# EAGLE design 1541-3mf (EAGLE 6.6.0)
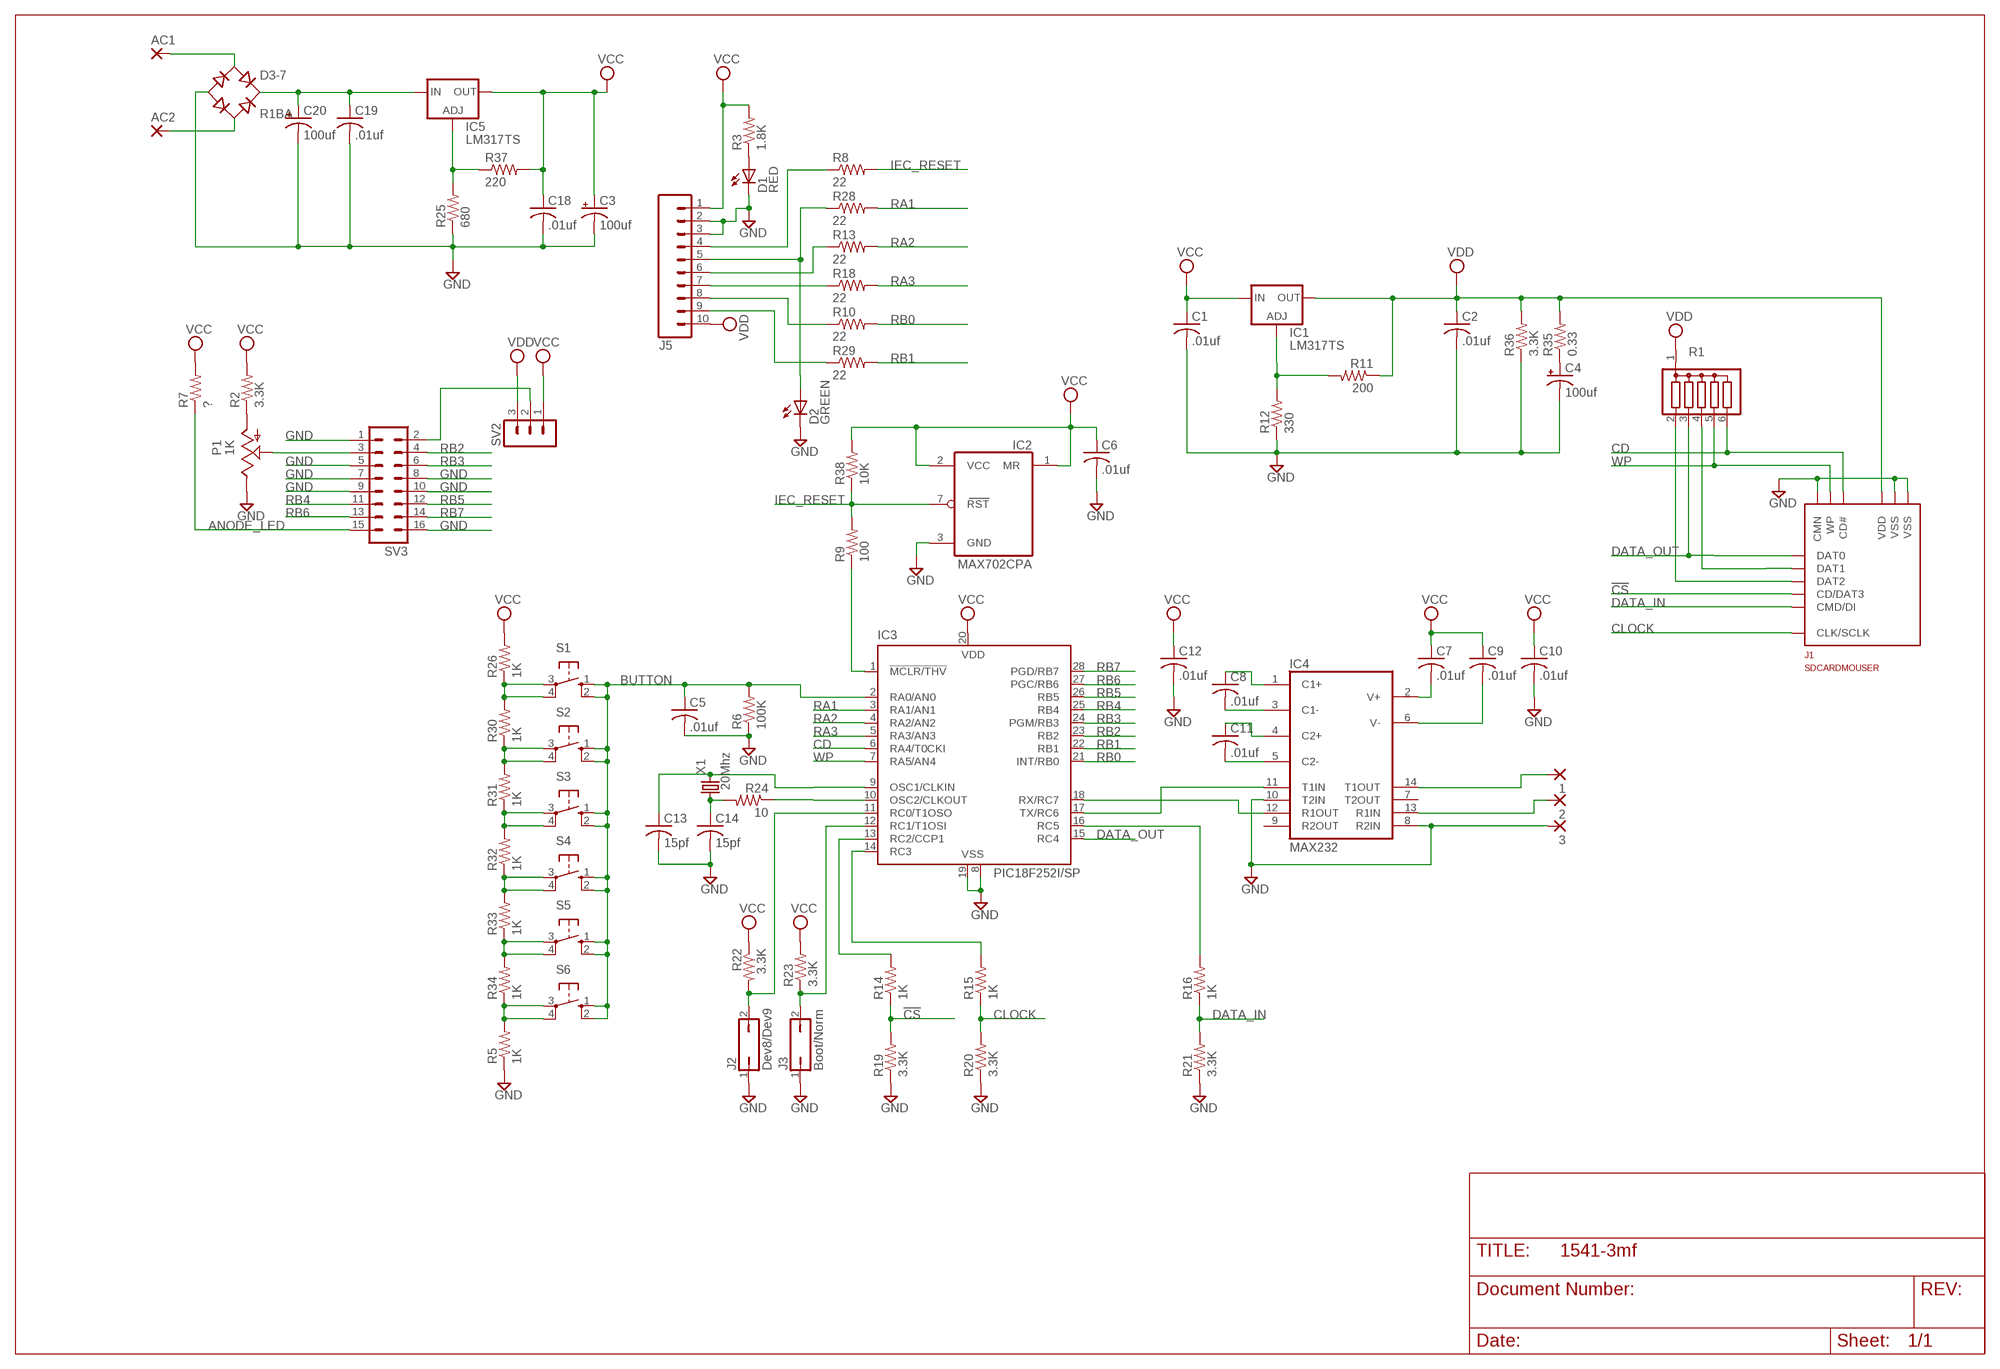
[diagram p0: schematic, sheet 1]

## Parts
1  2,15/1,0  [2,15/1,0]
2  2,15/1,0  [2,15/1,0]
3  2,15/1,0  [2,15/1,0]
AC1  2,15/1,0  [2,15/1,0]
AC2  2,15/1,0  [2,15/1,0]
C1  .01uf  C-US025-024X044  [C025-024X044]
C2  .01uf  C-US025-024X044  [C025-024X044]
C3  100uf  CPOL-USE2-5  [E2-5]
C4  100uf  CPOL-USE2-5  [E2-5]
C5  .01uf  C-US025-024X044  [C025-024X044]
C6  .01uf  C-US025-024X044  [C025-024X044]
C7  .01uf  C-US025-024X044  [C025-024X044]
C8  .01uf  C-US025-024X044  [C025-024X044]
C9  .01uf  C-US025-024X044  [C025-024X044]
C10  .01uf  C-US025-024X044  [C025-024X044]
C11  .01uf  C-US025-024X044  [C025-024X044]
C12  .01uf  C-US025-024X044  [C025-024X044]
C13  15pf  C-US025-024X044  [C025-024X044]
C14  15pf  C-US025-024X044  [C025-024X044]
C18  .01uf  C-US025-024X044  [C025-024X044]
C19  .01uf  C-US025-024X044  [C025-024X044]
C20  100uf  CPOL-USE2-5  [E2-5]
D1  RED  LED3MM  [LED3MM]
D2  GREEN  LED3MM  [LED3MM]
D3-7  R1BA  RB1A  [RB1A]
IC1  LM317TS  [317TS]
IC2  MAX702CPA  [DIL08]
IC3  PIC18F252I/SP  PIC16F870P  [DIL28-3]
IC4  MAX232  [DIL16]
IC5  LM317TS  [317TS]
J1  SDCARDMOUSER  [SCDA1A]
J2  Dev8/Dev9  JP1Q  [JP1]
J3  Boot/Norm  JP1Q  [JP1]
J5  M10  [10P]
P1  1K  TRIM_US-LI10  [LI10]
R1  G05R  [SIL6]
R2  3.3K  R-US_0207/7  [0207/7]
R3  1.8K  R-US_0207/7  [0207/7]
R5  1K  R-US_0207/7  [0207/7]
R6  100K  R-US_0207/7  [0207/7]
R7  ?  R-US_0207/7  [0207/7]
R8  22  R-US_0207/7  [0207/7]
R9  100  R-US_0207/7  [0207/7]
R10  22  R-US_0207/7  [0207/7]
R11  200  R-US_0207/7  [0207/7]
R12  330  R-US_0207/7  [0207/7]
R13  22  R-US_0207/7  [0207/7]
R14  1K  R-US_0207/7  [0207/7]
R15  1K  R-US_0207/7  [0207/7]
R16  1K  R-US_0207/7  [0207/7]
R18  22  R-US_0207/7  [0207/7]
R19  3.3K  R-US_0207/7  [0207/7]
R20  3.3K  R-US_0207/7  [0207/7]
R21  3.3K  R-US_0207/7  [0207/7]
R22  3.3K  R-US_0207/7  [0207/7]
R23  3.3K  R-US_0207/7  [0207/7]
R24  10  R-US_0207/7  [0207/7]
R25  680  R-US_0207/7  [0207/7]
R26  1K  R-US_0207/7  [0207/7]
R28  22  R-US_0207/7  [0207/7]
R29  22  R-US_0207/7  [0207/7]
R30  1K  R-US_0207/7  [0207/7]
R31  1K  R-US_0207/7  [0207/7]
R32  1K  R-US_0207/7  [0207/7]
R33  1K  R-US_0207/7  [0207/7]
R34  1K  R-US_0207/7  [0207/7]
R35  0.33  R-US_0207/7  [0207/7]
R36  3.3K  R-US_0207/7  [0207/7]
R37  220  R-US_0207/7  [0207/7]
R38  10K  R-US_0207/7  [0207/7]
S1  10-XX  [B3F-10XX]
S2  10-XX  [B3F-10XX]
S3  10-XX  [B3F-10XX]
S4  10-XX  [B3F-10XX]
S5  10-XX  [B3F-10XX]
S6  10-XX  [B3F-10XX]
SV2  MA03-1  [MA03-1]
SV3  ML16  [ML16]
X1  20Mhz  CRYSTALHC49U70  [HC49U70]

## Nets
!CS: J1.1(CD/DAT3) R14.1 R19.2
ANODE_LED: R7.1 SV3.15
BUTTON: C5.1 IC3.2(RA0/AN0) R6.2 S1.1(S) S1.2(S1) S2.1(S) S2.2(S1) S3.1(S) S3.2(S1) S4.1(S) S4.2(S1) S5.1(S) S5.2(S1) S6.1(S) S6.2(S1)
CD: IC3.6(RA4/T0CKI) J1.10(CD#) R1.6
CLOCK: J1.5(CLK/SCLK) R15.1 R20.2
DATA_IN: J1.2(CMD/DI) R16.1 R21.2
DATA_OUT: IC3.15(RC4) J1.7(DAT0) R1.3
GND: 3.1(P) C1.2 C2.2 C3.- C4.- C5.2 C6.2 C10.2 C12.2 C13.2 C14.2 C18.2 C19.2 C20.- D1.K(C) D2.K(C) D3-7.- IC2.3(GND) IC3.8(VSS) IC3.19(VSS) IC4.8(R2IN) IC4.10(T2IN) J1.3(VSS) J1.6(VSS) J1.11(CMN) J2.1 J3.1 J5.2 J5.3 P1.E R5.1 R6.1 R12.1 R19.1 R20.1 R21.1 R25.1 R36.1 SV3.1 SV3.5 SV3.7 SV3.8 SV3.9 SV3.10 SV3.16
IEC_RESET: IC2.7(RST) R8.2 R9.2 R38.1
N$1: C4.+ R35.1
N$2: J1.9(DAT2) R1.2
N$3: J1.8(DAT1) R1.4
N$4: J5.9 R29.1
N$5: J5.8 R10.1
N$6: J5.7 R18.1
N$7: J5.4 R8.1
N$8: D2.A J5.5 R28.1
N$9: J5.6 R13.1
N$10: D1.A R3.1
N$11: IC3.18(RX/RC7) IC4.12(R1OUT)
N$12: IC3.14(RC3) R15.2
N$13: C14.1 R24.2 X1.1
N$14: IC3.1(!MCLR/THV) R9.1
N$15: C11.1 IC4.4(C2+)
N$16: C11.2 IC4.5(C2-)
N$17: C8.2 IC4.3(C1-)
N$18: C8.1 IC4.1(C1+)
N$19: C7.2 IC4.2(V+)
N$20: C13.1 IC3.9(OSC1/CLKIN) X1.2
N$21: IC3.10(OSC2/CLKOUT) R24.1
N$22: IC3.12(RC1/T1OSI) J3.2 R23.1
N$23: IC3.11(RC0/T1OSO) J2.2 R22.2
N$24: IC3.13(RC2/CCP1) R14.2
N$25: IC3.16(RC5) R16.2
N$26: IC1.1(ADJ) R11.2 R12.2
N$27: IC3.17(TX/RC6) IC4.11(T1IN)
N$28: R26.1 R30.2 S1.3(P) S1.4(P1)
N$29: R30.1 R31.2 S2.3(P) S2.4(P1)
N$30: R31.1 R32.2 S3.3(P) S3.4(P1)
N$31: R5.2 R34.1 S6.3(P) S6.4(P1)
N$32: R33.1 R34.2 S5.3(P) S5.4(P1)
N$33: R32.1 R33.2 S4.3(P) S4.4(P1)
N$34: P1.A R2.1
N$35: SV2.2 SV3.2
N$36: P1.S SV3.3
N$37: C9.2 IC4.6(V-)
N$38: IC5.1(ADJ) R25.2 R37.1
N$39: AC1.1(P) D3-7.AC1
N$40: C19.1 C20.+ D3-7.+ IC5.3(IN)
N$41: AC2.1(P) D3-7.AC2
N$42: 2.1(P) IC4.13(R1IN)
N$43: 1.1(P) IC4.14(T1OUT)
RA1: IC3.3(RA1/AN1) R28.2
RA2: IC3.4(RA2/AN2) R13.2
RA3: IC3.5(RA3/AN3) R18.2
RB0: IC3.21(INT/RB0) R10.2
RB1: IC3.22(RB1) R29.2
RB2: IC3.23(RB2) SV3.4
RB3: IC3.24(PGM/RB3) SV3.6
RB4: IC3.25(RB4) SV3.11
RB5: IC3.26(RB5) SV3.12
RB6: IC3.27(PGC/RB6) SV3.13
RB7: IC3.28(PGD/RB7) SV3.14
VCC: C1.1 C3.+ C6.1 C7.1 C9.1 C10.1 C12.1 C18.1 IC1.3(IN) IC2.1(MR) IC2.2(VCC) IC3.20(VDD) IC5.2(OUT) J5.1 R2.2 R3.2 R7.2 R22.1 R23.2 R26.2 R37.2 R38.2 SV2.1
VDD: C2.1 IC1.2(OUT) J1.4(VDD) J5.10 R1.1 R11.1 R35.2 R36.2 SV2.3
WP: IC3.7(RA5/AN4) J1.12(WP) R1.5
Unconnected: IC4.7(T2OUT) IC4.9(R2OUT)

## Power pins joined to a net without a drawn wire
GND: IC4.15(GND) J1.13(GND) J1.14(GND)
VCC: IC4.16(VCC)

## Library data of the parts
1-3 AC1 AC2 = wirepad:2,15/1,0: THROUGH-HOLE PAD
C1 C2 C5-C14 C18 C19 = rcl:C-US: CAPACITOR, American symbol
C3 C4 C20 = rcl:CPOL-US: POLARIZED CAPACITOR, American symbol
D1 D2 = led:LED: LED OSRAM: - CHIPLED LG R971, LG N971, LY N971, LG Q971, LY Q971, LO R971, LY R971 LH N974, LH R974 LS Q976, LO Q976, LY Q976 LO Q996 - Hyper CHIPLED LW Q18S LB Q993, LB Q99A, LB R99A - SideLED LS A670, LO A670, LY A670, LG A670, LP A670 LB A673, LV A673, LT A673, LW A673 LH A674 LY A675 LS A676, LA A676, LO A676, LY A676, LW A676 LS A679, LY A679, LG A679 - Hyper Micro SIDELED® LS Y876, LA Y876, LO Y876, LY Y876 LT Y87S - SmartLED LW L88C, LW L88S LB L89C, LB L89S, LG L890 LS L89K, LO L89K, LY L89K LS L896, LA L896, LO L896, LY L896 - TOPLED LS T670, LO T670, LY T670, LG T670, LP T670 LSG T670, LSP T670, LSY T670, LOP T670, LYG T670 LG T671, LOG T671, LSG T671 LB T673, LV T673, LT T673, LW T673 LH T674 LS T676, LA T676, LO T676, LY T676, LB T676, LH T676, LSB T676, LW T676 LB T67C, LV T67C, LT T67C, LS T67K, LO T67K, LY T67K, LW E67C LS E67B, LA E67B, LO E67B, LY E67B, LB E67C, LV E67C, LT E67C LW T67C LS T679, LY T679, LG T679 LS T770, LO T770, LY T770, LG T770, LP T770 LB T773, LV T773, LT T773, LW T773 LH T774 LS E675, LA E675, LY E675, LS T675 LS T776, LA T776, LO T776, LY T776, LB T776 LHGB T686 LT T68C, LB T68C - Hyper Mini TOPLED® LB M676 - Mini TOPLED Santana® LG M470 LS M47K, LO M47K, LY M47K Source: http://www.osram.convergy.de LUXEON: - LUMILED® LXK2-PW12-R00, LXK2-PW12-S00, LXK2-PW14-U00, LXK2-PW14-V00 LXK2-PM12-R00, LXK2-PM12-S00, LXK2-PM14-U00 LXK2-PE12-Q00, LXK2-PE12-R00, LXK2-PE12-S00, LXK2-PE14-T00, LXK2-PE14-U00 LXK2-PB12-K00, LXK2-PB12-L00, LXK2-PB12-M00, LXK2-PB14-N00, LXK2-PB14-P00, LXK2-PB14-Q00 LXK2-PR12-L00, LXK2-PR12-M00, LXK2-PR14-Q00, LXK2-PR14-R00 LXK2-PD12-Q00, LXK2-PD12-R00, LXK2-PD12-S00 LXK2-PH12-R00, LXK2-PH12-S00 LXK2-PL12-P00, LXK2-PL12-Q00, LXK2-PL12-R00 Source: www.luxeon.com KINGBRIGHT: KA-3528ASYC Source: www.kingbright.com
D3-7 = rectifier:RB1A: RECTIFIER 1 A
IC1 IC5 = v-reg:LM317TS: VOLTAGE REGULATOR
IC2 = maxim:MAX702CPA: POWER SUPPLY MONITOR; MF: MAXIM; MPN: MAX702CPA+; OC_FARNELL: 1188018; OC_NEWARK: 69K6744
IC3 = microchip:PIC16*870: MICROCONTROLLER flash type; MF: MICROCHIP; MPN: PIC16F870-I/SP; OC_FARNELL: 9760954; OC_NEWARK: 19C7275
IC4 = maxim:MAX232: RS232 TRANSCEIVER; MF: MAXIM; MPN: MAX232ACPE+; OC_FARNELL: 9723773; OC_NEWARK: 68K4544
J1 = sdcards:SDCARD: SD Card Holder
J2 J3 = jumper:JP1Q: JUMPER
J5 = con-amp-quick:M10: AMP QUICK CONNECTOR; OC_FARNELL: unknown; OC_NEWARK: unknown
P1 = pot:TRIM_US-: POTENTIOMETER
R1 = resistor-sil:G05R: SIL RESISTOR; OC_FARNELL: unknown; OC_NEWARK: unknown
R2 R3 R5-R16 R18-R26 R28-R38 = rcl:R-US_: RESISTOR, American symbol
S1-S6 = switch-omron:10-XX: OMRON SWITCH; MPN: B3F-1000; OC_FARNELL: 176432; OC_NEWARK: 36M3542
SV2 = con-lstb:MA03-1: PIN HEADER; OC_FARNELL: unknown; OC_NEWARK: unknown
SV3 = con-harting-ml:ML16: HARTING; OC_FARNELL: unknown; OC_NEWARK: unknown
X1 = crystal:CRYSTAL: CRYSTAL; OC_FARNELL: unknown; OC_NEWARK: unknown

## Board
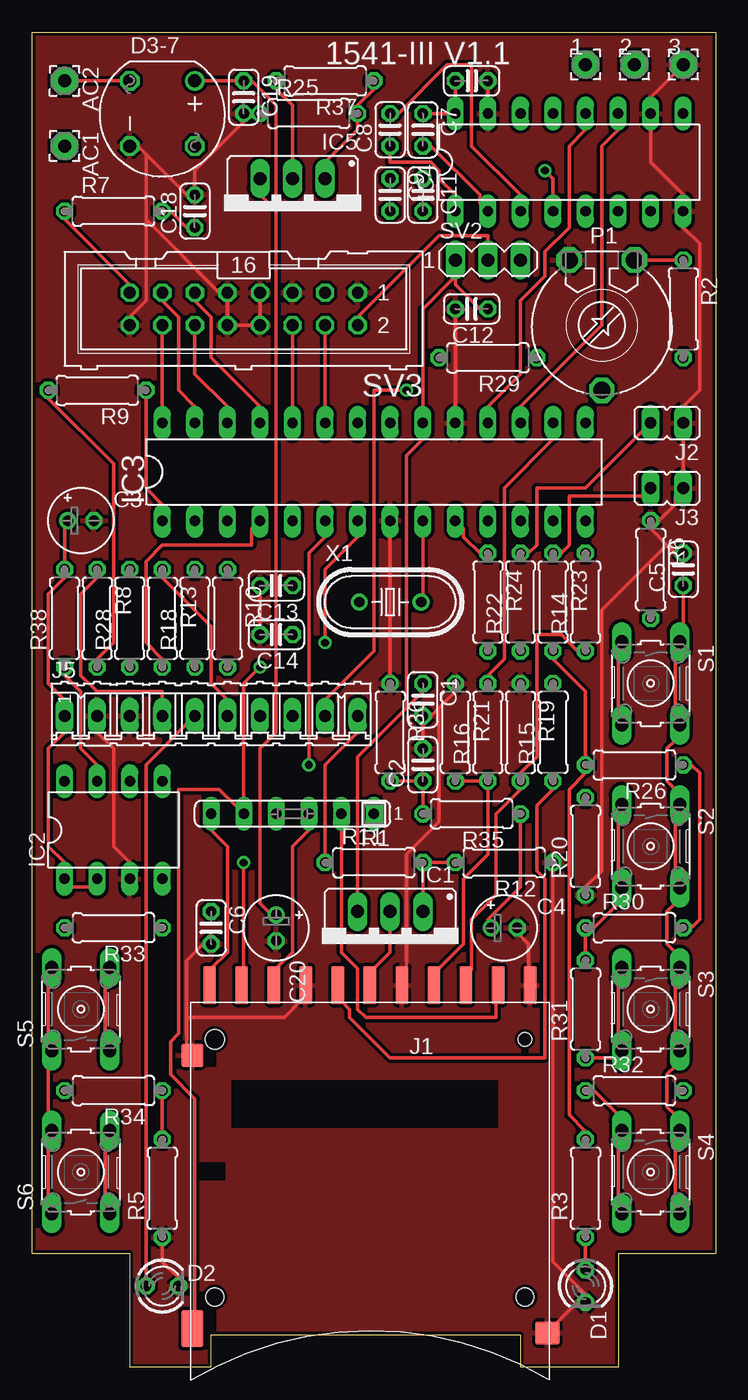
[diagram p1: board, top side]
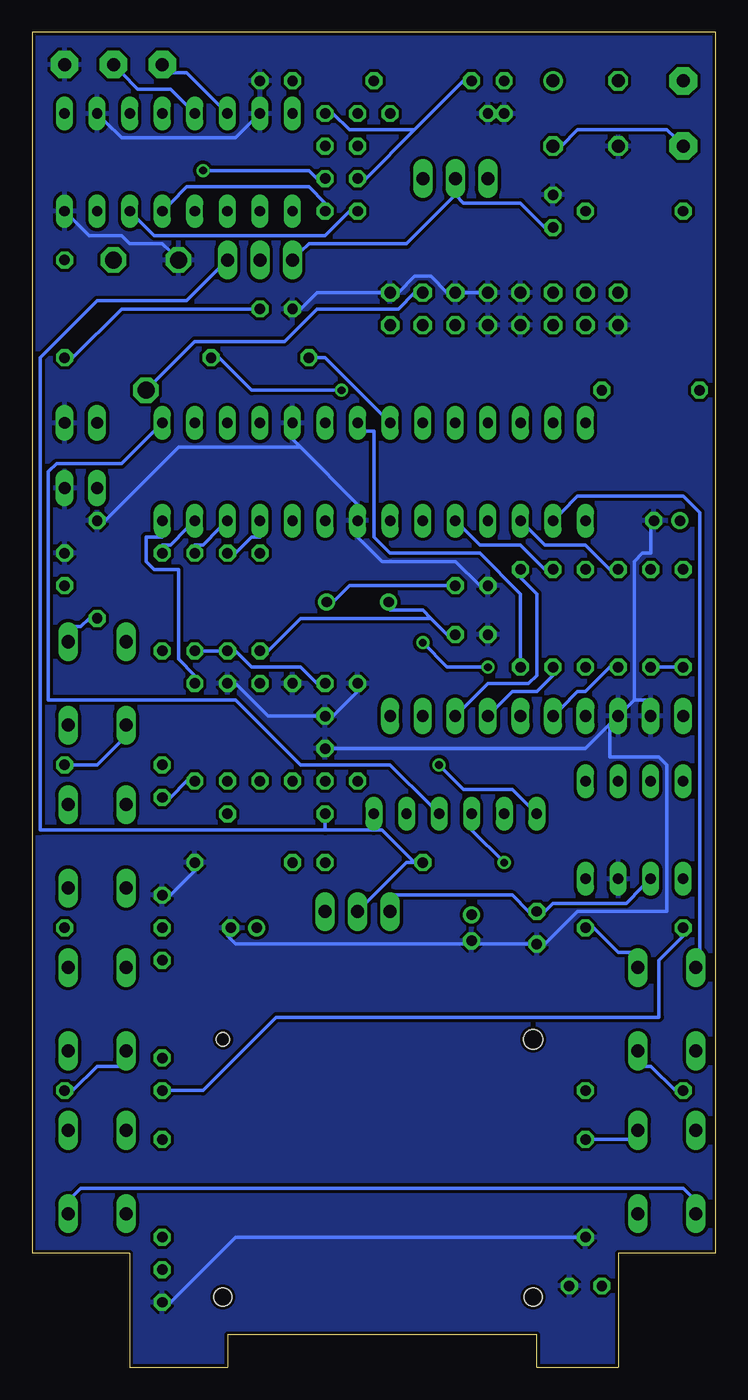
[diagram p2: board, bottom side, seen from below]

Size 53.34 x 104.14 mm. Coordinates in mm from the lower left corner, seen from the top.
Outline: 0,104.14 53.34,104.14 53.34,8.89 45.72,8.89 45.72,0 38.1,0 38.1,2.54 13.97,2.54 13.97,0 7.62,0 7.62,8.89 0,8.89 0,104.14
Copper layers (1*16): Top 0.035mm / dielectric 1.5mm / Bottom 0.035mm
Design rules "olimex10mil": minimum track width 10mil, minimum drill 24mil, track to track 10mil, track to pad 10mil, pad to pad 10mil, via to via 10mil, smd to smd 10mil, copper to edge 10mil, drill to drill 10mil, minimum pad ring 10mil, minimum via ring 8mil, stop-mask expansion 0mil, vias tented up to drill 0mil, thermal gap 10mil

### Footprints (pad centres in the part's own frame; a part is rotated, then mirrored left to right if it is on the bottom)
2,15/1,0 = drill 1.016 pad 2.159 octagon: 1 0,0
C025-024X044 = drill 0.813 octagon: 1 -1.27,0; 2 1.27,0
E2-5 = drill 0.813 pad 1.27: + -1.016,0 | drill 0.813 pad 1.27 octagon: - 1.016,0
LED3MM = drill 0.813 octagon: A -1.27,0; K 1.27,0
RB1A = drill 1.016: + -2.54,2.54 | drill 1.016 octagon: - 2.54,-2.54; AC1 2.54,2.54; AC2 -2.54,-2.54
317TS = drill 1.016 long: 1 -2.54,-2.54; 2 0,-2.54; 3 2.54,-2.54
DIL08 = drill 0.813 long: 1 -3.81,-3.81; 2 -1.27,-3.81; 3 1.27,-3.81; 4 3.81,-3.81; 5 3.81,3.81; 6 1.27,3.81; 7 -1.27,3.81; 8 -3.81,3.81
DIL28-3 = drill 0.813 long: 1 -16.51,-3.81; 2 -13.97,-3.81; 3 -11.43,-3.81; 4 -8.89,-3.81; 5 -6.35,-3.81; 6 -3.81,-3.81; 7 -1.27,-3.81; 8 1.27,-3.81; 9 3.81,-3.81; 10 6.35,-3.81; 11 8.89,-3.81; 12 11.43,-3.81; 13 13.97,-3.81; 14 16.51,-3.81; 15 16.51,3.81; 16 13.97,3.81; 17 11.43,3.81; 18 8.89,3.81; 19 6.35,3.81; 20 3.81,3.81; 21 1.27,3.81; 22 -1.27,3.81; 23 -3.81,3.81; 24 -6.35,3.81; 25 -8.89,3.81; 26 -11.43,3.81; 27 -13.97,3.81; 28 -16.51,3.81
DIL16 = drill 0.813 long: 1 -8.89,-3.81; 2 -6.35,-3.81; 3 -3.81,-3.81; 4 -1.27,-3.81; 5 1.27,-3.81; 6 3.81,-3.81; 7 6.35,-3.81; 8 8.89,-3.81; 9 8.89,3.81; 10 6.35,3.81; 11 3.81,3.81; 12 1.27,3.81; 13 -1.27,3.81; 14 -3.81,3.81; 15 -6.35,3.81; 16 -8.89,3.81
SCDA1A = smd 1 x 2.95: 1 -7.5,-10.125; 2 -5,-10.125; 3 -2.5,-10.125; 4 0,-10.125; 5 2.5,-10.125; 6 5,-10.125; 7 7.5,-10.125; 8 10,-10.125; 9 -10,-10.125; 10 12.5,-10.125; 13 -12.5,-10.125 | smd 1.7 x 1.8: 11 13.85,-4.65 | smd 1.7 x 2.9: 12 13.85,16.65 | smd 1.9 x 1.8: 14 -13.85,17 | hole 1.05: -12.1,-5.9 | hole 1.5: 12.1,-5.9 | hole 1.4: 12.1,14.2; -12.1,14.2
JP1 = drill 0.914 long: 1 0,-1.27; 2 0,1.27
10P = drill 0.914 long: 1 -11.43,0; 2 -8.89,0; 3 -6.35,0; 4 -3.81,0; 5 -1.27,0; 6 1.27,0; 7 3.81,0; 8 6.35,0; 9 8.89,0; 10 11.43,0
LI10 = drill 1.321 octagon: A -2.54,-5.08; E 2.54,-5.08; S 0,5.08
SIL6 = drill 0.813 long: 1 -6.35,0; 2 -3.81,0; 3 -1.27,0; 4 1.27,0; 5 3.81,0; 6 6.35,0
0207/7 = drill 0.813 octagon: 1 -3.81,0; 2 3.81,0
B3F-10XX = drill 1.016 long: 1 -3.251,2.261; 2 3.251,2.261; 3 -3.251,-2.261; 4 3.251,-2.261
MA03-1 = drill 1.016 long: 1 -2.54,0; 2 0,0; 3 2.54,0
ML16 = drill 0.914 octagon: 1 -8.89,-1.27; 2 -8.89,1.27; 3 -6.35,-1.27; 4 -6.35,1.27; 5 -3.81,-1.27; 6 -3.81,1.27; 7 -1.27,-1.27; 8 -1.27,1.27; 9 1.27,-1.27; 10 1.27,1.27; 11 3.81,-1.27; 12 3.81,1.27; 13 6.35,-1.27; 14 6.35,1.27; 15 8.89,-1.27; 16 8.89,1.27
HC49U70 = drill 0.813: 1 -2.413,0; 2 2.413,0

### Placement (x,y rotation side)
1  43.18,101.6 0 top
2  46.99,101.6 0 top
3  50.8,101.6 0 top
AC1  2.54,95.25 270 top
AC2  2.54,100.33 270 top
C1  30.48,52.07 270 top
C2  30.48,46.99 90 top
C3  3.81,66.04 0 top
C4  36.83,34.29 0 top
C5  50.8,62.23 90 top
C6  13.97,34.29 270 top
C7  30.48,96.52 270 top
C8  27.94,96.52 90 top
C9  27.94,91.44 270 top
C10  34.29,100.33 0 top
C11  30.48,91.44 270 top
C12  34.29,82.55 180 top
C13  19.05,60.96 180 top
C14  19.05,57.15 180 top
C18  12.7,90.17 90 top
C19  16.51,99.06 270 top
C20  19.05,34.29 270 top
D1  43.18,6.35 270 top
D2  10.16,6.35 0 top
D3-7  10.16,97.79 270 top
IC1  27.94,33.02 180 top
IC2  6.35,41.91 0 top
IC3  26.67,69.85 0 top
IC4  41.91,93.98 0 top
IC5  20.32,90.17 180 top
J1  26.35,19.68 180 top
J2  49.53,73.66 90 top
J3  49.53,68.58 90 top
J5  13.97,50.8 0 top
P1  44.45,81.28 180 top
R1  20.32,43.18 180 top
R2  50.8,82.55 270 top
R3  43.18,13.97 90 top
R5  10.16,13.97 90 top
R6  48.26,62.23 270 top
R7  6.35,90.17 0 top
R8  5.08,58.42 270 top
R9  5.08,76.2 180 top
R10  15.24,58.42 270 top
R11  26.67,39.37 0 top
R12  36.83,39.37 180 top
R13  10.16,58.42 270 top
R14  43.18,59.69 90 top
R15  40.64,49.53 90 top
R16  35.56,49.53 90 top
R18  12.7,58.42 90 top
R19  38.1,49.53 270 top
R20  43.18,40.64 90 top
R21  33.02,49.53 270 top
R22  38.1,59.69 90 top
R23  40.64,59.69 270 top
R24  35.56,59.69 270 top
R25  21.59,97.79 0 top
R26  46.99,46.99 180 top
R28  7.62,58.42 90 top
R29  35.56,78.74 180 top
R30  46.99,34.29 0 top
R31  43.18,27.94 90 top
R32  46.99,21.59 0 top
R33  6.35,34.29 180 top
R34  6.35,21.59 180 top
R35  34.29,43.18 180 top
R36  27.94,49.53 270 top
R37  22.86,100.33 180 top
R38  2.54,58.42 90 top
S1  48.26,53.34 270 top
S2  48.26,40.64 270 top
S3  48.26,27.94 270 top
S4  48.26,15.24 270 top
S5  3.81,27.94 90 top
S6  3.81,15.24 90 top
SV2  35.56,86.36 0 top
SV3  16.51,82.55 180 top
X1  27.94,59.69 0 top

### Tracks (layer width: path | path; a pad name or v marks a point on that pad's centre or on a via)
!CS
  Top 0.254: J1.1 34.29,31.11 34.29,34.92 36.2,36.83 36.2,43.18 38.1,45.09 R19.2 38.1,46.35 39.37,47.62 39.37,57.15 41.27,57.15 42.55,55.88 R14.1
ANODE_LED
  Top 0.254: R7.1 2.54,89.53 7.62,84.45 SV3.15
BUTTON
  Top 0.254: C5.1 50.8,60.33 50.8,57.78 S1.1 50.16,55.24 50.16,51.44 S1.2 50.16,48.9 49.53,48.26 49.53,45.72 50.16,45.09 S2.1 50.16,42.55 50.16,38.73 S2.2 50.16,36.2 49.53,35.56 49.53,33.02 50.16,32.38 S3.1 50.16,29.84 50.16,26.04 S3.2 50.16,23.5 49.53,22.86 49.53,20.32 50.16,19.68 S4.1 50.16,17.14 50.16,13.34 S4.2 | S6.1 1.27,13.34 1.27,17.14 S6.2 1.27,19.68 1.27,23.5 S5.1 1.27,26.04 1.27,29.84 S5.2
  Bottom 0.254: R6.2 48.9,58.42 49.53,57.78 50.16,57.78 S1.1 | IC3.2 12.06,66.67 10.79,67.94 2.54,67.94 1.27,66.67 1.27,32.38 S5.2 | S4.2 50.16,13.34 49.53,13.97 2.54,13.97 1.91,13.34 S6.1
CD  (via drill 0.61)
  Top 0.254: R1.6 13.97,41.91 15.24,40.64 15.24,32.38 13.97,31.11 J1.10 | v21.59,46.99 21.59,63.5 22.86,64.77 IC3.6
  Bottom 0.254: v21.59,46.99 19.68,45.09 15.88,45.09 14.61,43.81 R1.6
CLOCK
  Top 0.254: J1.5 24.13,28.57 24.77,27.94 24.77,27.3 27.94,24.13 40.01,24.13 40.01,38.1 39.37,38.73 39.37,43.81 40.64,45.09 R15.1
  Bottom 0.254: R20.2 42.55,44.45 41.27,45.72 R15.1
DATA_IN
  Top 0.254: R21.2 33.66,45.72 34.92,45.72 R16.1 35.56,45.09 35.56,40.01 33.66,38.1 33.66,33.02 31.75,31.11 J1.2
DATA_OUT
  Top 0.254: R1.3 21.59,41.91 20.32,40.64 20.32,32.38 19.05,31.11 J1.7
  Bottom 0.254: IC3.15 43.81,73.03 46.35,70.48 51.44,70.48 52.07,69.85 52.07,52.07 37.47,52.07 32.38,46.99 25.4,46.99 22.23,43.81 R1.3
GND
  Top 0.254: IC2.3 7.62,39.37 6.35,40.64 6.35,48.26 5.08,49.53 J5.2 | C2.2 30.48,48.9 30.48,50.16 C1.2 31.11,50.8 31.75,51.44 | 31.75,51.44 33.02,52.7 R21.1 | 31.75,51.44 31.75,42.55 29.21,40.01 29.21,31.11 J1.3 | J1.14 40.64,3.17 42.55,5.08 D1.K 43.18,5.71 40.64,8.26 40.64,38.73 R12.1 | D2.K 11.43,6.99 10.16,8.26 10.16,9.53 R5.1 | 12.06,27.3 12.06,31.75 13.34,33.02 C6.2 | 12.06,27.3 12.06,24.77 J1.11 | 12.06,27.3 19.68,27.3 20.95,28.57 J1.6 | IC4.15 35.56,99.06 35.56,99.69 C10.2 | 3.1 50.16,100.97 48.26,99.06 IC4.10 48.26,96.52 48.26,93.98 50.8,91.44 IC4.8 50.8,88.9 52.07,87.63 52.07,76.2 50.8,74.93 J2.1 50.8,72.39 50.8,69.85 J3.1 50.16,67.94 50.16,67.31 48.9,66.04 R6.1 48.26,65.41 49.53,64.14 | SV3.7 17.78,83.19 17.78,81.92 SV3.8 17.14,81.28 15.88,81.28 SV3.10 15.24,81.92 15.24,83.19 SV3.9 14.61,83.82 8.89,89.53 | R25.1 17.14,97.79 C19.2 16.51,97.16 12.7,93.34 12.7,92.08 C18.2 12.06,91.44 8.89,94.61 | 8.89,94.61 8.26,95.25 D3-7.- | 8.89,89.53 8.89,94.61 | 8.89,89.53 8.89,83.19 7.62,81.92 SV3.16 | 49.53,64.14 50.16,63.5 C5.2 | C14.2 17.78,57.78 17.78,60.33 C13.2 | C12.2 33.02,81.92 33.02,74.93 IC3.19 | 49.53,64.14 44.45,59.05 44.45,38.73 43.18,37.47 R20.1 | R36.1 27.94,53.98 27.94,64.77 IC3.8 | J1.13 38.73,31.11 38.73,33.02 38.1,33.66 C4.-
  Bottom 0.254: R36.1 27.94,52.7 29.84,50.8 C1.2 31.11,50.8 34.92,50.8 37.47,53.34 R19.1 | 8.26,50.16 10.16,48.26 29.84,48.26 C2.2 | 8.26,50.16 J5.3 | D1.K 42.55,5.08 37.47,10.16 10.79,10.16 R5.1 | IC4.15 36.2,97.16 37.47,95.89 46.35,95.89 47.62,97.16 IC4.10 | P1.E 42.55,87 43.18,87.63 45.72,87.63 46.35,88.27 48.9,88.27 50.16,89.53 IC4.8 | SV3.7 18.41,83.82 19.68,83.82 SV3.5 20.95,83.82 22.23,85.09 23.5,85.09 24.77,83.82 SV3.1 26.04,83.82 31.11,83.82 32.38,82.55 C12.2 | 32.38,71.75 33.02,72.39 IC3.19 | 32.38,71.75 27.94,67.31 IC3.8 27.94,64.77 26.04,62.87 20.32,62.87 18.41,60.96 C13.2 | 32.38,71.75 41.91,71.75 47.62,66.04 R6.1 | 8.26,50.16 8.26,47.62 4.45,47.62 3.81,46.99 3.81,35.56 10.79,35.56 13.34,33.02 C6.2 14.61,33.02 18.41,33.02 C20.- 19.68,33.02 37.47,33.02 38.1,33.66 C4.- | 8.26,50.16 J5.3 | 6.35,52.07 6.35,62.87 5.71,63.5 5.08,63.5 5.08,65.41 C3.- | 6.35,52.07 5.08,52.07 J5.2 | 6.35,52.07 6.99,51.44 J5.3 | R12.1 40.64,38.73 42.55,36.83 R20.1
  pour Bottom: 0,0 53.34,0 53.34,104.14 0,104.14
  pour Top: 0,0 53.34,0 53.34,104.14 0,104.14
IEC_RESET
  Top 0.254: R9.2 1.27,75.56 6.35,70.48 6.35,56.52 5.08,55.24 R8.2 | IC2.7 5.08,46.99 3.81,48.26 3.81,52.7 2.54,53.98 R38.1
  Bottom 0.254: R38.1 3.17,54.61 4.45,54.61 R8.2
N$1
  Top 0.254: R35.1 38.1,42.55 38.1,37.47 35.56,34.92 C4.+
N$2
  Top 0.254: R1.2 24.13,41.91 24.13,32.38 25.4,31.11 25.4,27.94 26.04,27.3 36.2,27.3 36.2,28.57 J1.9
N$3  (via drill 0.61)
  Top 0.254: v16.51,39.37 16.51,31.11 J1.8
  Bottom 0.254: v16.51,39.37 19.05,41.91 R1.4
N$4  (via drill 0.61)
  Top 0.254: v29.21,76.2 26.67,76.2 26.67,55.88 22.86,52.07 J5.9
  Bottom 0.254: v29.21,76.2 36.2,76.2 38.73,78.74 R29.1
N$5
  Bottom 0.254: R10.1 15.24,61.59 13.97,60.33 13.97,53.98 14.61,53.34 17.78,53.34 19.68,51.44 J5.8
N$6
  Bottom 0.254: R18.1 12.7,53.98 13.97,52.7 15.88,52.7 17.14,51.44 J5.7
N$7
  Top 0.254: R8.1 5.08,61.59 3.81,60.33 3.81,53.98 5.08,52.7 10.16,52.7 10.16,52.07 J5.4
N$8
  Top 0.254: D2.A 8.89,6.99 8.89,46.99 12.06,50.16 J5.5
  Bottom 0.254: R28.1 8.26,54.61 10.16,52.7 10.79,52.7 12.06,51.44 J5.5
N$9
  Top 0.254: R13.1 10.16,61.59 13.97,57.78 13.97,53.34 15.24,52.07 J5.6
N$10
  Top 0.254: D1.A 43.18,8.26 43.18,9.53 R3.1
N$11
  Top 0.254: IC3.18 35.56,74.93 38.1,77.47 38.1,83.19 40.01,85.09 40.01,87 41.91,88.9 41.91,95.25 43.18,96.52 IC4.12
N$12
  Bottom 0.254: R15.2 40.64,53.98 41.91,55.24 41.91,62.23 43.81,62.23 44.45,62.87 44.45,64.77 43.18,64.77 IC3.14
N$13
  Bottom 0.254: 22.23,58.42 22.86,59.05 25.4,59.05 X1.1 | 22.23,58.42 20.95,57.15 C14.1 | 22.23,58.42 32.38,58.42 34.92,55.88 R24.2
N$14
  Top 0.254: IC3.1 10.16,67.31 8.89,68.58 8.89,75.56 R9.1
N$15  (via drill 0.61)
  Top 0.254: v40.01,93.34 40.64,92.71 40.64,91.44 IC4.4
  Bottom 0.254: v40.01,93.34 31.75,93.34 31.11,92.71 C11.1
N$16
  Bottom 0.254: C11.2 30.48,90.81 31.75,92.08 41.27,92.08 42.55,90.81 IC4.5
N$17
  Top 0.254: C8.2 28.57,97.79 32.38,101.6 34.29,101.6 34.29,95.25 38.1,91.44 IC4.3
N$18
  Top 0.254: IC4.1 33.02,91.44 31.75,92.71 31.75,93.34 31.11,93.98 27.94,93.98 27.94,94.61 C8.1
N$19
  Top 0.254: C7.2 31.11,95.25 34.92,91.44 34.92,90.81 IC4.2
N$20
  Top 0.254: IC3.9 30.48,64.77 30.48,60.33 X1.2
  Bottom 0.254: C13.1 20.95,60.96 28.57,60.96 29.84,59.69 X1.2
N$21
  Top 0.254: R24.1 34.92,63.5 33.66,64.77 33.66,65.41 IC3.10
N$22
  Top 0.254: J3.2 47.62,67.94 41.91,67.94 41.91,64.14 41.27,63.5 R23.1
  Bottom 0.254: IC3.12 38.73,65.41 40.01,64.14 40.64,64.14 R23.1
N$23
  Top 0.254: J2.2 47.62,73.03 43.18,68.58 39.37,68.58 39.37,64.14 38.73,63.5 R22.2
  Bottom 0.254: R22.2 37.47,63.5 36.2,64.77 35.56,64.77 IC3.11
N$24
  Bottom 0.254: IC3.13 41.27,65.41 42.55,64.14 43.18,64.14 R14.2
N$25
  Top 0.254: R16.2 35.56,53.98 36.83,55.24 36.83,68.58 40.64,72.39 IC3.16
N$26
  Top 0.254: R12.2 32.38,39.37 31.11,39.37 R11.2 30.48,38.73 IC1.1
N$27
  Top 0.254: IC3.17 38.1,74.93 44.45,81.28 44.45,95.25 45.72,96.52 IC4.11
N$28
  Top 0.254: S1.4 45.72,51.44 45.72,55.24 S1.3 | R30.2 51.44,34.29 52.07,34.92 52.07,46.35 51.44,46.99 R26.1
  Bottom 0.254: S1.4 46.35,48.9 48.26,46.99 50.16,46.99 R26.1
N$29
  Top 0.254: R31.2 43.18,32.38 43.18,33.66 R30.1 43.81,34.29 45.72,36.2 S2.4 45.72,38.73 45.72,42.55 S2.3
N$30
  Top 0.254: R31.1 43.81,24.13 45.72,24.13 S3.4 45.72,26.04 45.72,29.84 S3.3
  Bottom 0.254: R32.2 50.16,21.59 48.26,23.5 46.35,23.5 S3.4
N$31
  Top 0.254: R5.2 10.16,18.41 10.16,20.95 R34.1 | S6.3 5.71,13.34 5.71,17.14 S6.4
  Bottom 0.254: R5.2 9.53,17.78 6.35,17.78 S6.4
N$32
  Top 0.254: S5.3 5.71,26.04 5.71,29.84 S5.4
  Bottom 0.254: R34.2 3.17,21.59 5.08,23.5 5.71,23.5 S5.3 | R33.1 9.53,34.29 7.62,32.38 6.35,32.38 S5.4
N$33
  Top 0.254: S4.4 45.72,13.34 45.72,17.14 S4.3 45.72,19.68 43.81,21.59 R32.1
  Bottom 0.254: R33.2 2.54,33.66 4.45,31.75 4.45,27.3 34.29,27.3 40.01,21.59 42.55,21.59 R32.1
N$34
  Top 0.254: R2.1 50.16,86.36 47.62,86.36 P1.A
N$35
  Top 0.254: SV3.2 25.4,81.92 31.75,88.27 35.56,88.27 35.56,87.63 SV2.2
N$36
  Bottom 0.254: SV3.3 23.5,83.82 24.77,82.55 31.11,82.55 33.66,80.01 40.64,80.01 43.81,76.83 P1.S
N$37
  Bottom 0.254: C9.2 28.57,90.17 30.48,88.27 43.81,88.27 45.09,89.53 IC4.6
N$38
  Top 0.254: R37.1 26.67,99.69 25.4,98.42 R25.2 25.4,97.16 25.4,96.52 22.86,93.98 IC5.1
N$39
  Bottom 0.254: D3-7.AC1 12.06,95.25 10.79,96.52 3.81,96.52 3.17,95.89 AC1.1
N$40
  Top 0.254: D3-7.+ 13.34,100.33 15.88,100.33 C19.1 17.14,100.33 19.05,98.42 19.05,90.17 | 19.05,90.17 19.05,49.53 17.78,48.26 17.78,36.2 18.41,35.56 C20.+ | 19.05,90.17 17.78,91.44 IC5.3
N$41
  Top 0.254: D3-7.AC2 6.99,100.33 3.17,100.33 AC2.1
N$42
  Bottom 0.254: IC4.13 41.27,98.42 42.55,99.69 45.09,99.69 46.35,100.97 2.1
N$43
  Bottom 0.254: IC4.14 38.73,98.42 41.27,100.97 42.55,100.97 1.1
RA1
  Bottom 0.254: R28.2 8.26,62.23 10.16,64.14 13.34,64.14 14.61,65.41 IC3.3
RA2
  Top 0.254: R13.2 10.16,55.24 8.89,56.52 8.89,62.87 10.16,64.14 17.14,64.14 17.14,65.41 IC3.4
RA3
  Bottom 0.254: R18.2 13.34,62.23 15.24,64.14 18.41,64.14 19.68,65.41 IC3.5
RB0
  Bottom 0.254: R10.2 15.24,55.24 15.24,60.33 18.41,63.5 25.4,63.5 26.67,64.77 26.67,73.03 27.3,73.03 IC3.21
RB1
  Bottom 0.254: IC3.22 26.04,74.3 30.48,78.74 31.11,78.74 R29.2
RB2
  Top 0.254: IC3.23 22.86,74.93 22.86,80.64 SV3.4
RB3
  Top 0.254: IC3.24 20.32,74.93 20.32,80.64 SV3.6
RB4
  Top 0.254: IC3.25 17.78,74.93 13.97,78.74 13.97,81.92 12.7,83.19 SV3.11
RB5
  Top 0.254: IC3.26 15.24,74.93 12.7,77.47 12.7,80.64 SV3.12
RB6
  Top 0.254: IC3.27 12.7,74.93 11.43,76.2 11.43,81.92 10.16,83.19 SV3.13
RB7
  Top 0.254: IC3.28 10.16,74.93 10.16,80.64 SV3.14
VCC
  Top 0.254: 33.02,85.09 30.48,82.55 30.48,74.93 IC3.20 30.48,72.39 29.21,71.12 29.21,51.44 | 33.02,85.09 SV2.1 33.02,85.09 | 33.02,85.09 33.02,84.45 34.92,82.55 C12.1 | C7.1 31.11,97.79 32.38,97.79 IC4.16 33.02,99.06 33.02,99.69 C10.1 | R7.2 10.79,90.17 12.06,88.9 C18.1 | R37.2 19.05,99.69 20.32,98.42 20.32,93.98 IC5.2 | R3.2 43.18,18.41 41.91,19.68 41.91,45.09 43.18,46.35 R26.2 43.18,47.62 43.18,52.7 40.64,55.24 R23.2 | IC2.2 4.45,37.47 3.17,37.47 IC2.1 2.54,39.37 1.27,40.64 1.27,48.26 2.54,49.53 J5.1 2.54,52.07 1.27,53.34 1.27,60.33 2.54,61.59 R38.2 2.54,62.87 2.54,65.41 C3.+ | 29.21,51.44 25.4,47.62 IC1.3 | 29.21,51.44 30.48,52.7 C1.1
  Bottom 0.254: R2.2 50.16,78.74 46.35,82.55 36.2,82.55 C12.1 | 23.5,96.52 19.68,100.33 R37.2 | 23.5,96.52 27.3,92.71 C9.1 | 20.32,91.44 19.68,90.81 15.24,90.81 13.34,88.9 C18.1 | 20.32,91.44 IC5.2 20.32,91.44 | 23.5,96.52 28.57,96.52 29.84,97.79 C7.1 | 20.32,91.44 24.13,87.63 31.75,87.63 32.38,87 SV2.1 | C1.1 31.11,53.34 32.38,54.61 36.2,54.61 37.47,55.88 R22.1 38.73,55.88 40.01,55.88 R23.2 | IC2.2 5.71,37.47 6.99,36.2 12.7,36.2 13.34,35.56 C6.1 14.61,35.56 15.88,36.83 25.4,36.83 IC1.3
VDD
  Top 0.254: J1.4 26.67,31.11 27.94,32.38 27.94,33.02 IC1.2 | R35.2 30.48,43.81 30.48,45.09 C2.1 29.84,45.72 28.57,45.72 R36.2 | J5.10 25.4,49.53 22.86,46.99 22.86,40.01 R11.1
  Bottom 0.254: 23.5,39.37 26.04,41.91 26.67,41.91 | 23.5,39.37 R11.1 23.5,39.37 | 26.67,41.91 R1.1 26.67,41.91 | 26.67,41.91 30.48,41.91 | 30.48,41.91 52.7,41.91 52.7,78.74 48.26,83.19 41.27,83.19 38.73,85.72 SV2.3 | 30.48,41.91 30.48,42.55 R35.2 | IC1.2 24.13,39.37 23.5,39.37
WP  (via drill 0.61)
  Top 0.254: J1.12 12.7,4.45 12.7,20.95 10.79,22.86 10.79,25.4 11.43,26.04 11.43,45.09 14.61,45.09 15.88,43.81 R1.5 16.51,44.45 16.51,53.34 v17.78,54.61 | v22.86,56.52 22.86,62.23 25.4,64.77 IC3.7
  Bottom 0.254: v22.86,56.52 20.95,54.61 v17.78,54.61

### Text on the board
Dimension: Mount Caps from back.
tPlace: 1541-III V1.1